# Altium schematic sheet USB0.1.SchDoc
size A4
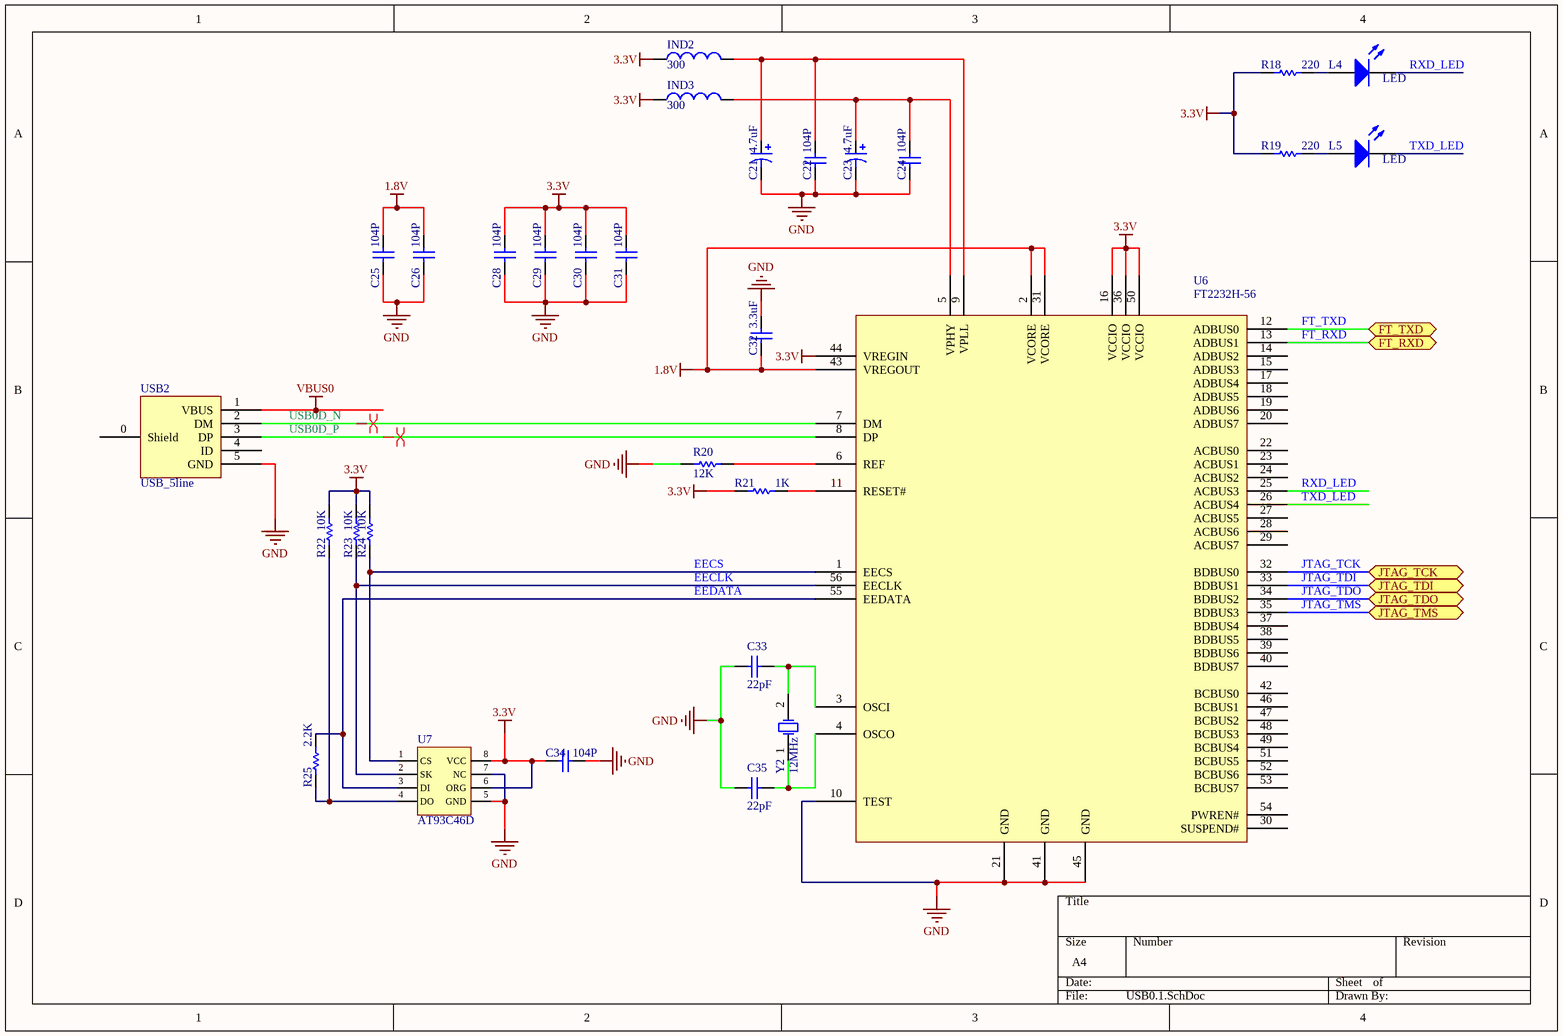
[diagram p0: USB0.1.SchDoc]

## Parts
C21  value 4.7uF  [1608[0603]]  (hidden comment: Cap Pol1)
C22  value 104P  [1608[0603]]  (hidden comment: Cap)
C23  value 4.7uF  [1608[0603]]  (hidden comment: Cap Pol1)
C24  value 104P  [1608[0603]]  (hidden comment: Cap)
C25  value 104P  [1608[0603]]  (hidden comment: Cap)
C26  value 104P  [1608[0603]]  (hidden comment: Cap)
C28  value 104P  [1608[0603]]  (hidden comment: Cap)
C29  value 104P  [1608[0603]]  (hidden comment: Cap)
C30  value 104P  [1608[0603]]  (hidden comment: Cap)
C31  value 104P  [1608[0603]]  (hidden comment: Cap)
C32  value 3.3uF  [1608[0603]]  (hidden comment: Cap)
C33  value 22pF  [1608[0603]]  (hidden comment: Cap)
C34  value 104P  [1608[0603]]  (hidden comment: Cap)
C35  value 22pF  [1608[0603]]  (hidden comment: Cap)
IND2  value 300  [0402]  (hidden comment: Inductor)
IND3  value 300  [0402]  (hidden comment: Inductor)
L4  LED  [1608[0603]]
L5  LED  [1608[0603]]
R18  value 220  [1608[0603]]  (hidden comment: Res)
R19  value 220  [1608[0603]]  (hidden comment: Res)
R20  value 12K  [1608[0603]]  (hidden comment: Res)
R21  value 1K  [1608[0603]]  (hidden comment: Res)
R22  value 10K  [1608[0603]]  (hidden comment: Res)
R23  value 10K  [1608[0603]]  (hidden comment: Res)
R24  value 10K  [1608[0603]]  (hidden comment: Res)
R25  value 2.2K  [1608[0603]]  (hidden comment: Res)
U6  FT2232H-56  [QFN50P800X800X90_HS-57N]
U7  AT93C46D  [TSOP65P640X120-8N-AT93C46D]
USB2  USB_5line  [USB-MICRO-5P-2F]
Y2  12MHz  [5032]

## Ports
FT_RXD, FT_TXD, JTAG_TCK, JTAG_TDI, JTAG_TDO, JTAG_TMS

## Nets
1.8V: C25.2 C26.2 C32.1 U6.2(VCORE) U6.31(VCORE) U6.43(VREGOUT)
3.3V: C28.2 C29.2 C30.2 C31.2 C34.2 IND2.1 IND3.1 R18.2 R19.2 R21.2 R22.1 R23.1 R24.1 U6.16(VCCIO) U6.36(VCCIO) U6.44(VREGIN) U6.50(VCCIO) U7.6(ORG) U7.8(VCC)
GND: C21.2 C22.1 C23.2 C24.1 C25.1 C26.1 C28.1 C29.1 C30.1 C31.1 C32.2 C33.1 C34.1 C35.2 R20.2 U6.10(TEST) U6.21(GND) U6.41(GND) U6.45(GND) U7.5(GND) U7.7(NC) USB2.5(GND)
VBUS0: USB2.1(VBUS)
EECLK: R23.2 U6.56(EECLK) U7.2(SK)
EECS: R24.2 U6.1(EECS) U7.1(CS)
EEDATA: R25.1 U6.55(EEDATA) U7.3(DI)
FT_RXD: U6.13(ADBUS1) ; port FT_RXD
FT_TXD: U6.12(ADBUS0) ; port FT_TXD
JTAG_TCK: U6.32(BDBUS0) ; port JTAG_TCK
JTAG_TDI: U6.33(BDBUS1) ; port JTAG_TDI
JTAG_TDO: U6.34(BDBUS2) ; port JTAG_TDO
JTAG_TMS: U6.35(BDBUS3) ; port JTAG_TMS
RXD_LED: L4.2(K) U6.25(ACBUS3)
TXD_LED: L5.2(K) U6.26(ACBUS4)
USB0D_N: U6.7(DM) USB2.2(DM)
USB0D_P: U6.8(DP) USB2.3(DP)
NetC21_1: C21.1 C22.2 IND2.2 U6.9(VPLL)
NetC23_1: C23.1 C24.2 IND3.2 U6.5(VPHY)
NetC33_2: C33.2 U6.3(OSCI) Y2.2(OSC2)
NetC35_1: C35.1 U6.4(OSCO) Y2.1(OSC1)
NetL4_1: L4.1(A) R18.1
NetL5_1: L5.1(A) R19.1
NetR20_1: R20.1 U6.6(REF)
NetR21_1: R21.1 U6.11(RESET#)
NetR22_2: R22.2 R25.2 U7.4(DO)

Not connected (* = marked no-connect by the designer): U6 14(ADBUS2) 15(ADBUS3) 17(ADBUS4) 18(ADBUS5) 19(ADBUS6) 20(ADBUS7) 22(ACBUS0) 23(ACBUS1) 24(ACBUS2) 27(ACBUS5) 28(ACBUS6) 29(ACBUS7) 30(SUSPEND#) 37(BDBUS4) 38(BDBUS5) 39(BDBUS6) 40(BDBUS7) 42(BCBUS0) 46(BCBUS1) 47(BCBUS2) 48(BCBUS3) 49(BCBUS4) 51(BCBUS5) 52(BCBUS6) 53(BCBUS7) 54(PWREN#); USB2 0(Shield) 4(ID)

## Layout directives
differential pair: USB0D_N, USB0D_P

## Library data of the parts
C21 C23 = Cap Pol1: Polarized Capacitor (Radial); Published: 8-Jun-2000; LatestRevisionDate: 17-Jul-2002; LatestRevisionNote: Re-released for DXP Platform.; PackageReference: RB7.6-15; Publisher: Altium Limited; PackageDescription: Polarized Capacitor (Radial); 2 Leads
C22 C24-C26 C28-C35 = Cap: 贴片电容; Published: 8-Jun-2000; LatestRevisionDate: 17-Jul-2002; LatestRevisionNote: Re-released for DXP Platform.; PackageReference: RAD-0.3; Publisher: Altium Limited
IND2 IND3 = Inductor: Code_IEC: 1005; Published: 8-Jun-2000; LatestRevisionDate: 29-May-2009; LatestRevisionNote: IPC-7351 Footprint Added.; PackageReference: 0402-A; Publisher: Altium Limited; PackageDescription: Chip Inductor; Code_JEITA: 0402
R18-R25 = Res: 贴片电阻; Published: 8-Jun-2000; LatestRevisionDate: 17-Jul-2002; LatestRevisionNote: Re-released for DXP Platform.; PackageReference: AXIAL-0.3; Publisher: Altium Limited
Y2 = XTAL: 晶体振荡器; Published: 8-Jun-2000; LatestRevisionDate: 17-Jul-2002; LatestRevisionNote: Re-released for DXP Platform.; PackageReference: R38; Publisher: Altium Limited